# EAGLE design 000044 XXX Rev 1.00 (EAGLE 9.6.2)
DATE: 01.07.2020; OWNER: Kallio Designs; PCBA_PN: XXXXXX; PCB_PN: XXXXXX; REVISION: 1.0; TITLE: Modify global attributes; Z_SHEET2: Sheet 2; Z_SHEET3: Sheet 3; Z_SHEET4: Sheet 4; Z_SHEET5: Sheet 5; Z_SHEET6: Sheet 6; Z_SHEET7: Sheet 7; Z_SHEET8: Sheet 8
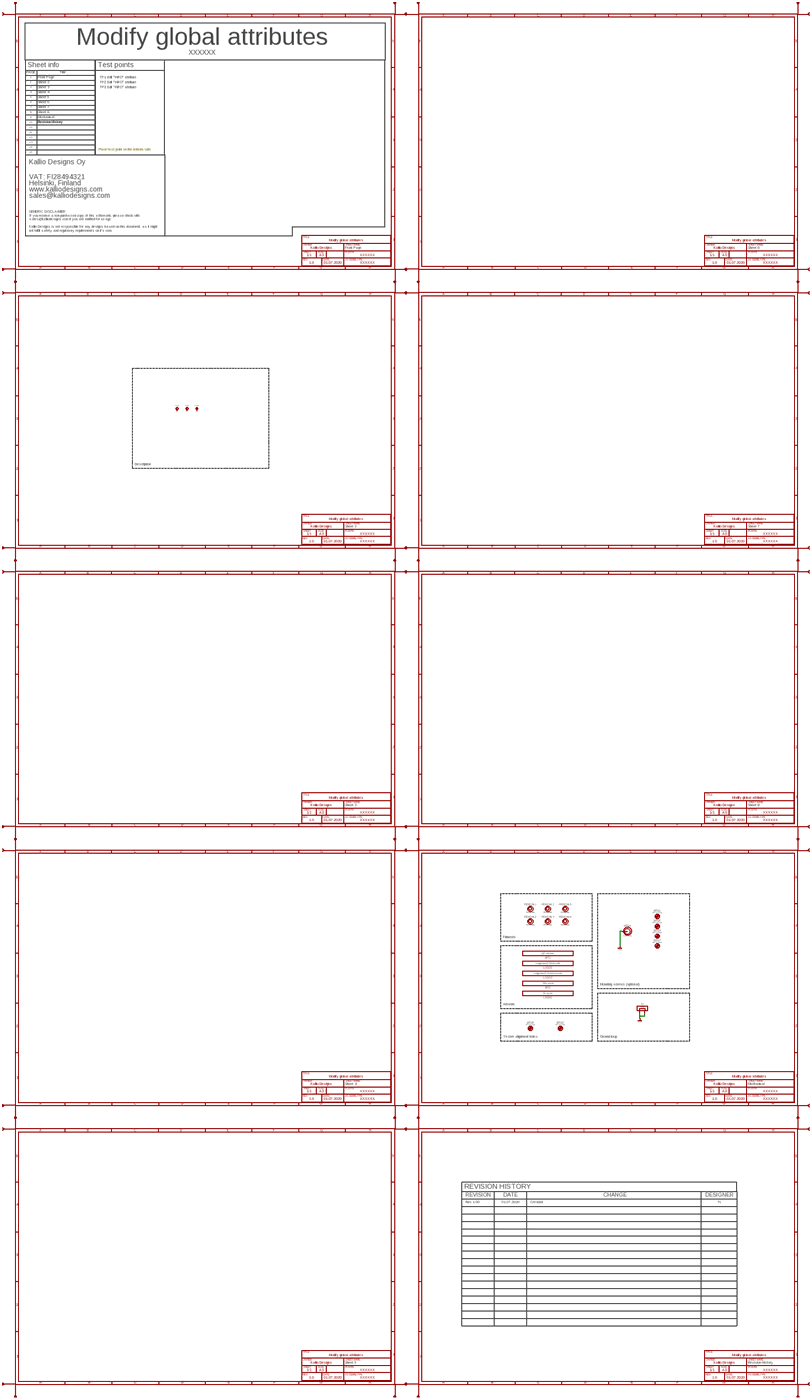
[diagram p0: schematic, sheet 1, overview]
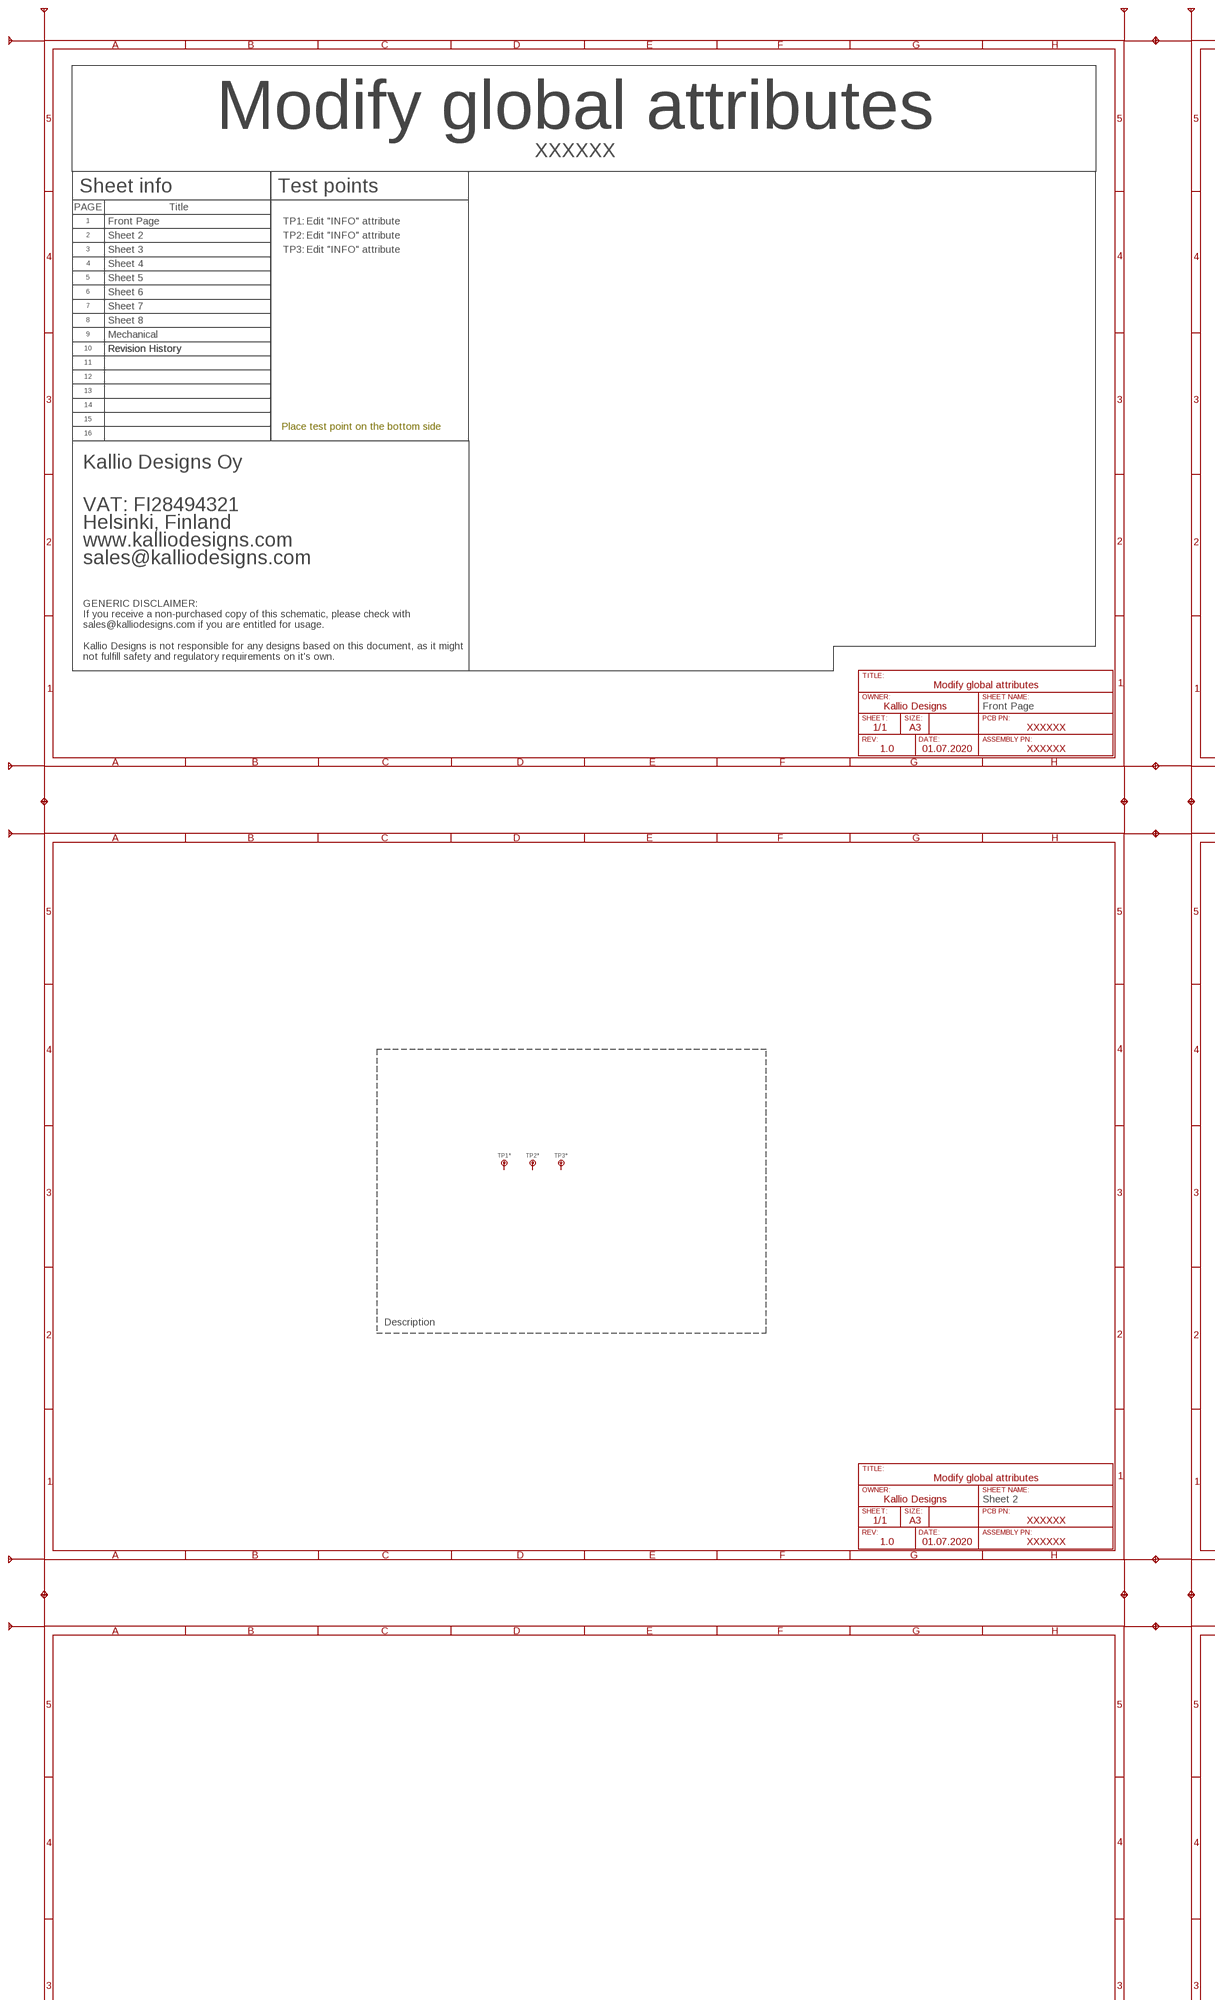
[diagram p1: schematic, sheet 1, part 1 of 4]
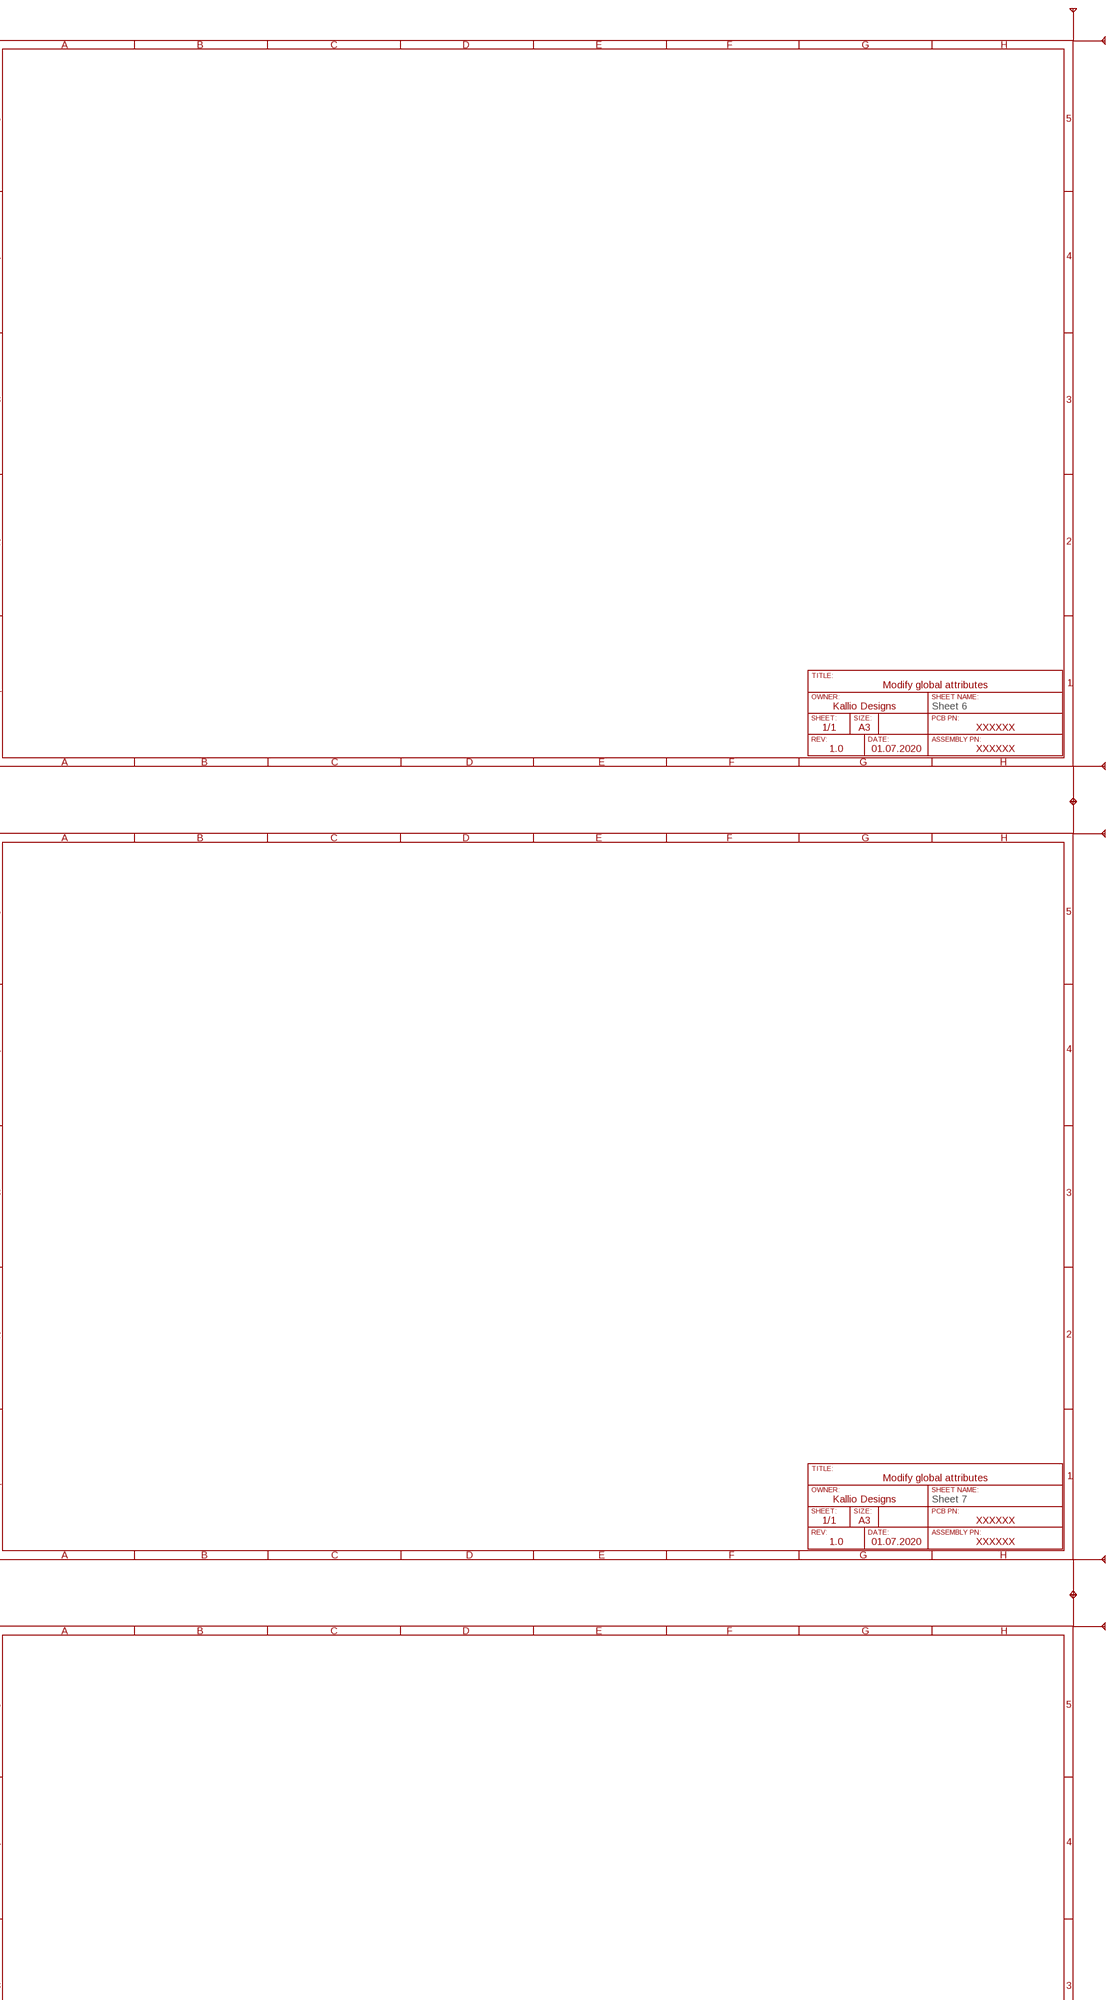
[diagram p2: schematic, sheet 1, part 2 of 4]
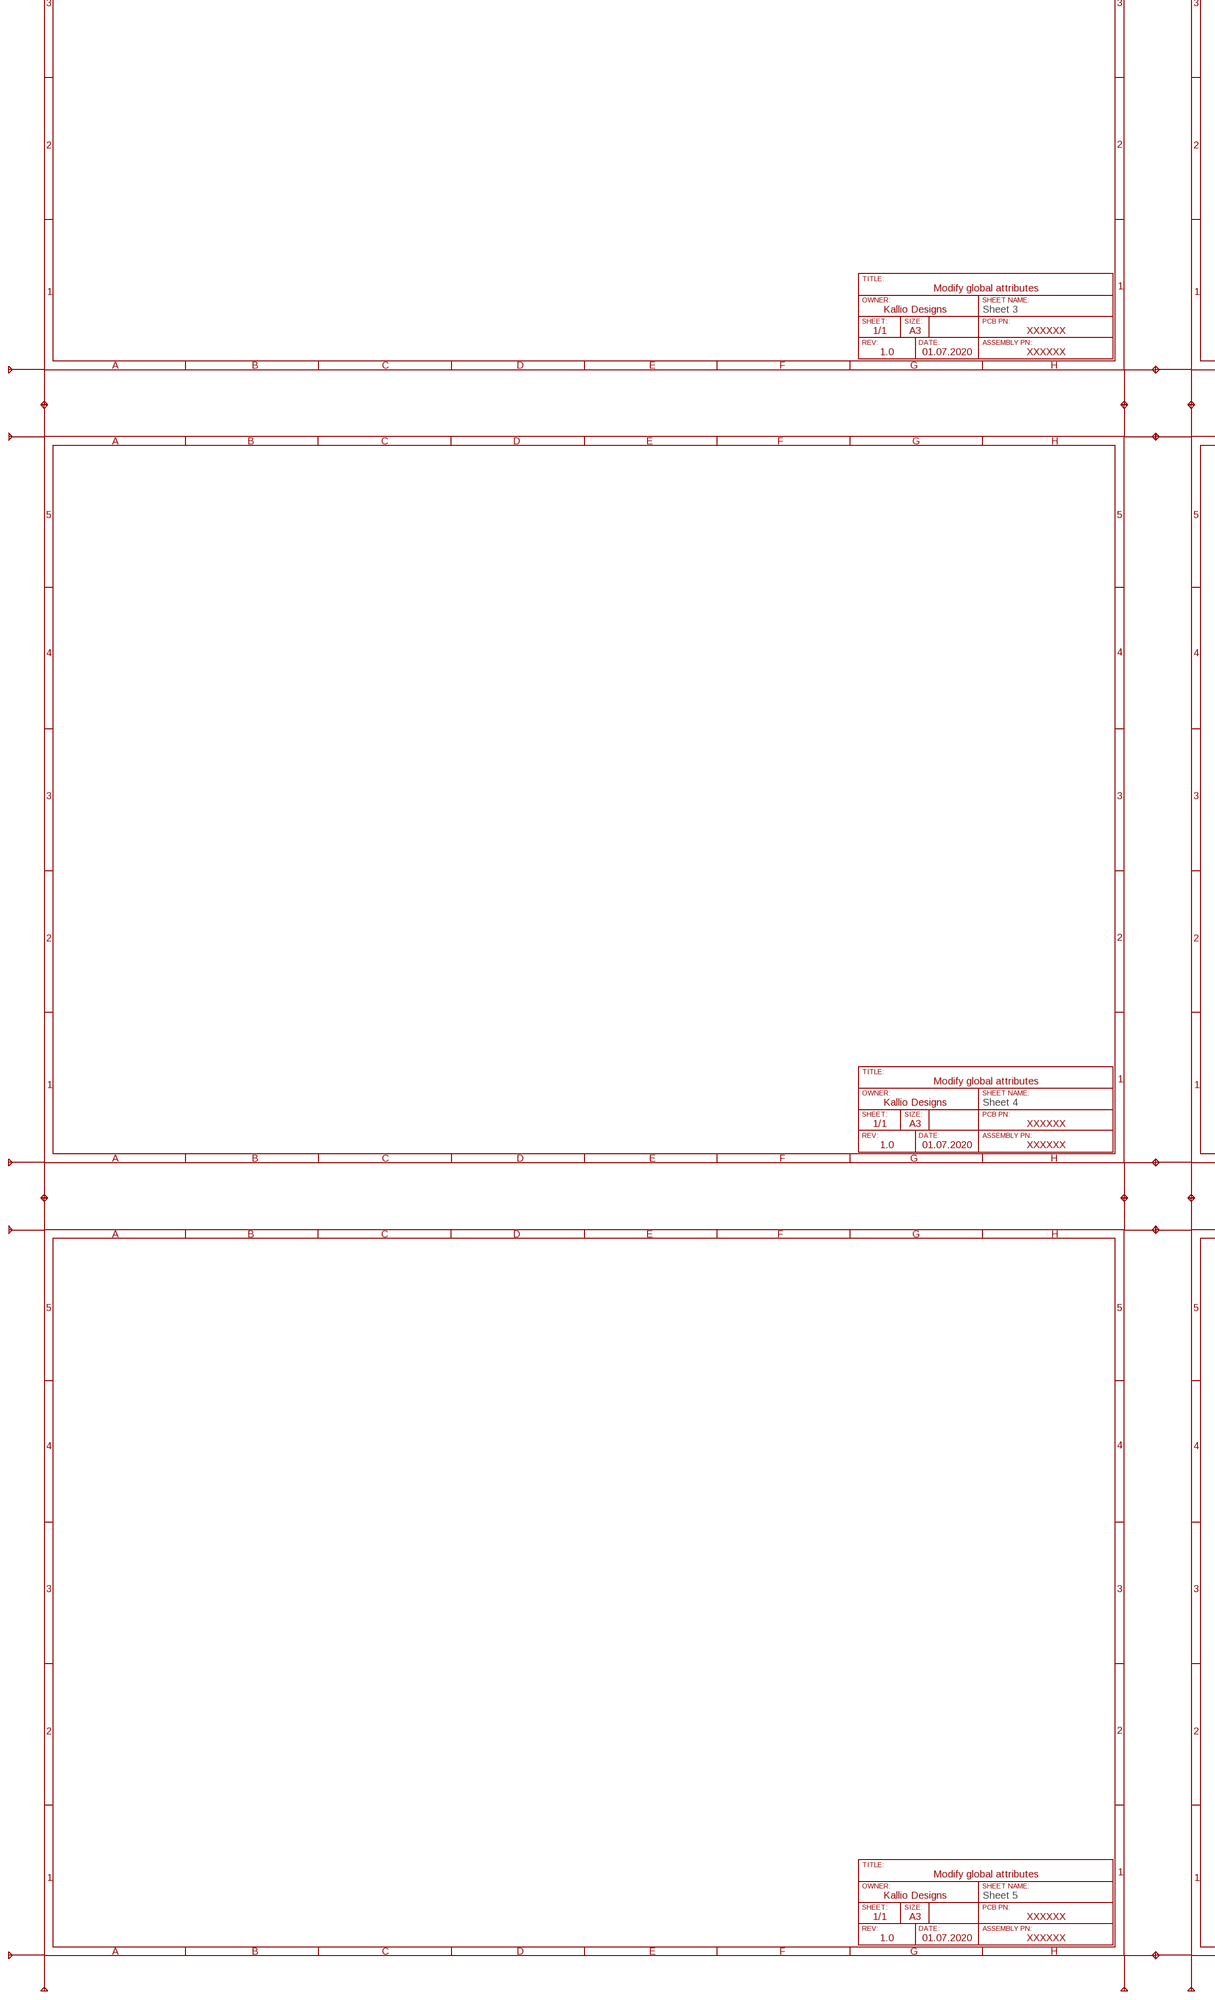
[diagram p3: schematic, sheet 1, part 3 of 4]
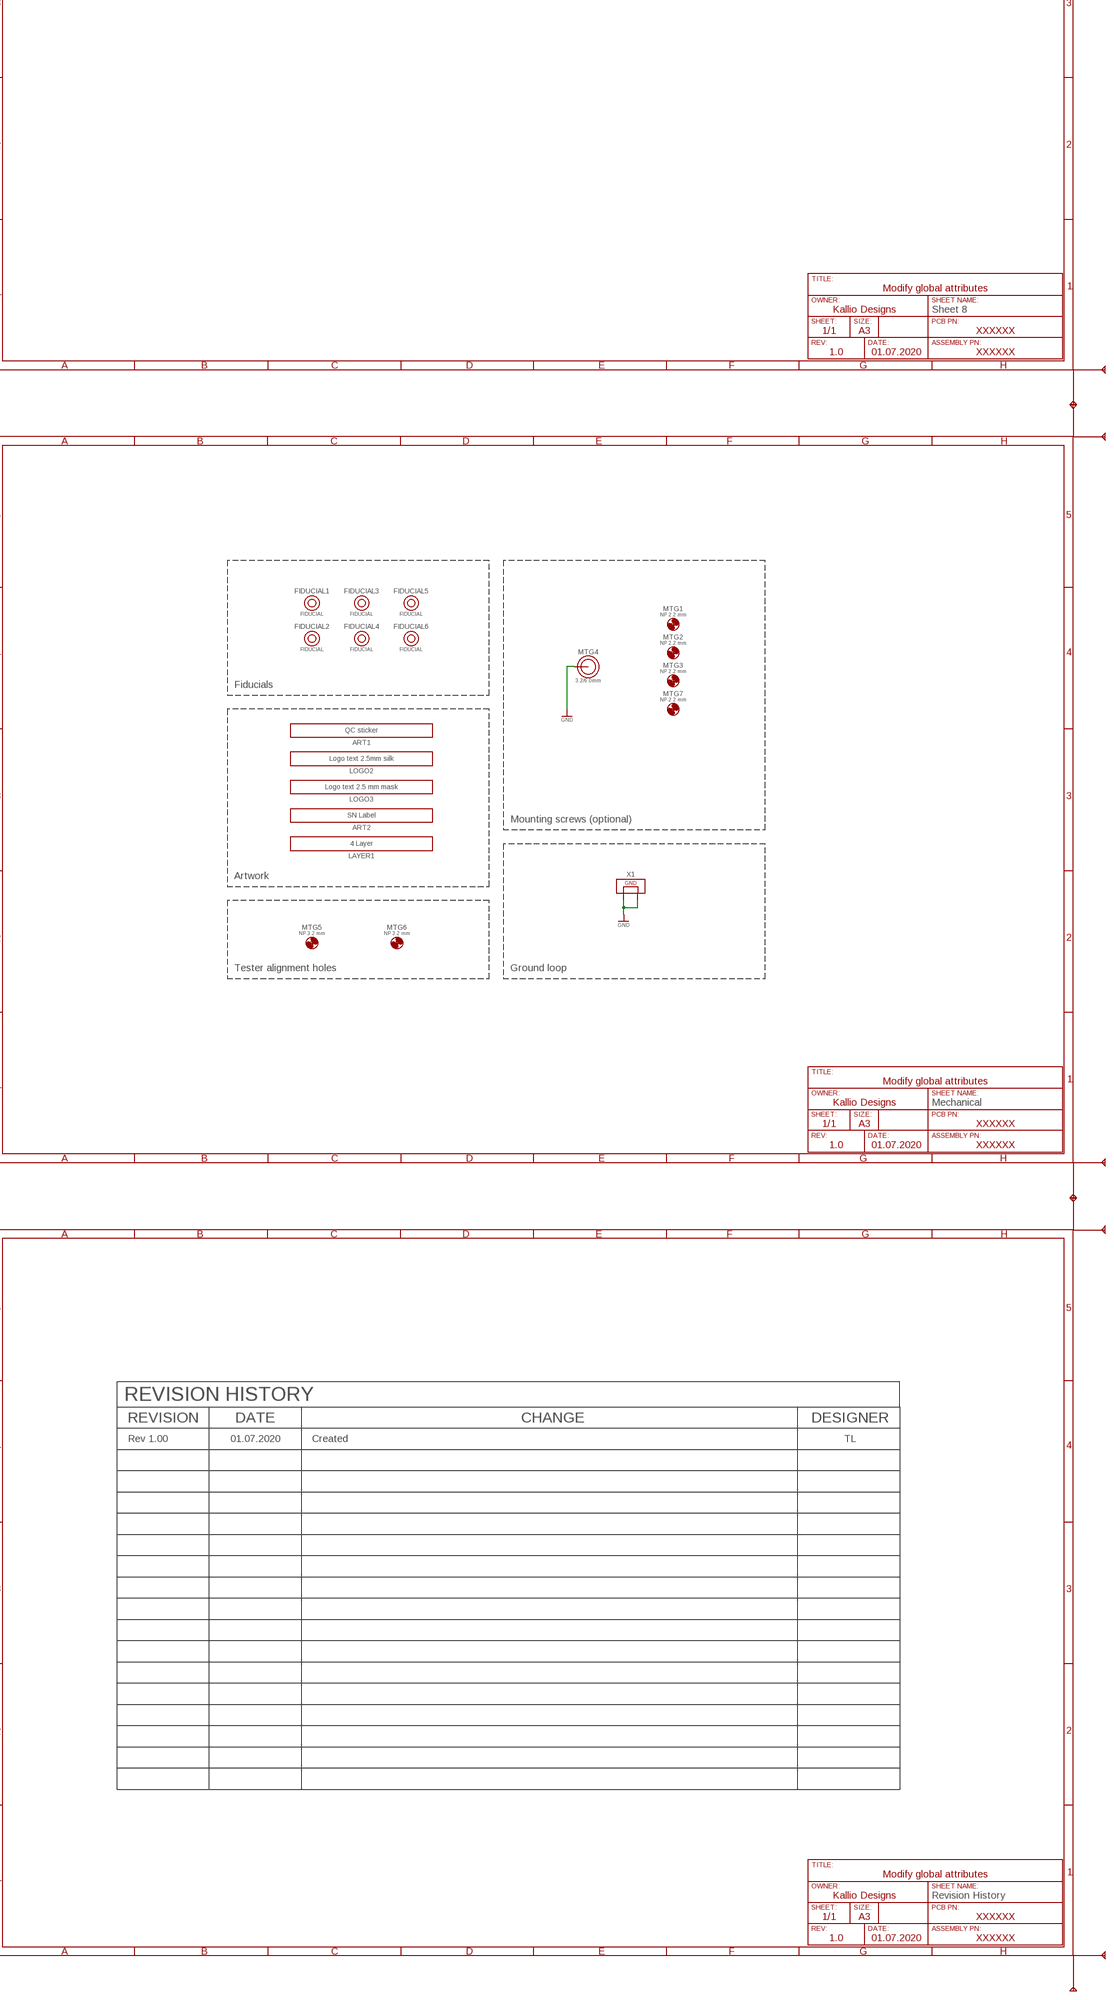
[diagram p4: schematic, sheet 1, part 4 of 4]
REVINFO1 (ART_REVISION_HISTORY): CODE: DNP; DNP: T; MANUFACTURER: DNP; MFG_PARTNO: DNP; PRICE: 0; SUPPLIER: DNP; SUPPLIER_PARTNO: DNP
SHEETINFO1 (ART_SHEET_INFO_1-16): CODE: DNP; DNP: T; MANUFACTURER: DNP; MFG_PARTNO: DNP; PRICE: 0; SUPPLIER: DNP; SUPPLIER_PARTNO: DNP
TEST_POINTS1 (ART_TEST_POINTS): CODE: DNP; DNP: T; MANUFACTURER: DNP; MFG_PARTNO: DNP; PRICE: 0; SUPPLIER: DNP; SUPPLIER_PARTNO: DNP

## Parts
ART1  ART_QC  [ART_QC_BIG]
ART2  ART_SN_LABEL-08X24  [ART_SN_8X24]
FIDUCIAL1  FIDUCIAL  [FIDUCIAL]
FIDUCIAL2  FIDUCIAL  [FIDUCIAL]
FIDUCIAL3  FIDUCIAL  [FIDUCIAL]
FIDUCIAL4  FIDUCIAL  [FIDUCIAL]
FIDUCIAL5  FIDUCIAL  [FIDUCIAL]
FIDUCIAL6  FIDUCIAL  [FIDUCIAL]
LAYER1  ART_LAYER_MARKING-4LAYER  [ART_4LAYER]
LOGO2  ART_LOGO_TEXT_2.5MM-SILK  [ART_LOGO_TEXT_2.5MM_SILK]
LOGO3  ART_LOGO_TEXT_2.5MM-MASK  [ART_LOGO_TEXT_2.5MM_MASK]
MTG1  HOL_2.2/4.2_NP  [MTG_NP_M2_220X420]
MTG2  HOL_2.2/4.2_NP  [MTG_NP_M2_220X420]
MTG3  HOL_2.2/4.2_NP  [MTG_NP_M2_220X420]
MTG4  HOL_3.2/6.0_PTH-3.2/6.0_PTH  [MTG_PTH_M3_320X600]
MTG5  HOL_3.2/6.0_NP-NOSILK  [MTG_NP_M3_320X600_NOSILK]
MTG6  HOL_3.2/6.0_NP-NOSILK  [MTG_NP_M3_320X600_NOSILK]
MTG7  HOL_2.2/4.2_NP  [MTG_NP_M2_220X420]
TP1  PAD_TEST_POINT-2.5MM  [TEST_POINT_2.5MM]
TP2  PAD_TEST_POINT-2.5MM  [TEST_POINT_2.5MM]
TP3  PAD_TEST_POINT-2.5MM  [TEST_POINT_2.5MM]
X1  PAD_TEST_GROUND_HOOK  [PAD_GND_HOOK_M]

## Nets
GND [100V/1A]: MTG4.1 X1.P$1 X1.P$2
Unconnected: TP1.P$1 TP2.P$1 TP3.P$1

## Notes on the sheet
- Front Page
- Mechanical
- Revision History | Revision History
- Place test point on the bottom side
- Kallio Designs Oy
- VAT: FI28494321
- Helsinki, Finland
- www.kalliodesigns.com
- sales@kalliodesigns.com
- GENERIC DISCLAIMER:
  If you receive a non-purchased copy of this schematic, please check with
  sales@kalliodesigns.com if you are entitled for usage.
  
  Kallio Designs is not responsible for any designs based on this document, as it might
  not fulfill safety and regulatory requirements on it's own.
- Front Page
- Description
- Fiducials
- Mounting screws (optional)
- Artwork
- Tester alignment holes | Ground loop
- Mechanical
- Rev 1.00 | 01.07.2020 | Created | TL
- Revision History

## Library data of the parts
ART1 = Custom_Eagle_KD:ART_QC: Placeholder for quality control sticker; CODE: QC sticker; DNP: T; MANUFACTURER: DNP; MFG_PARTNO: DNP; PRICE: 0; SUPPLIER: Digi-Key; SUPPLIER_PARTNO: DNP
ART2 = Custom_Eagle_KD:ART_SN_LABEL: Placeholder for serial number sticker; CODE: SN Label; DNP: T; MANUFACTURER: DNP; MFG_PARTNO: DNP; PRICE: 0; SUPPLIER: Digi-Key; SUPPLIER_PARTNO: DNP
FIDUCIAL1-FIDUCIAL6 = Custom_Eagle_KD:FIDUCIAL; CODE: FIDUCIAL; DNP: T; MANUFACTURER: DNP; MFG_PARTNO: DNP; SUPPLIER: DNP; SUPPLIER_PARTNO: DNP
LAYER1 = Custom_Eagle_KD:ART_LAYER_MARKING: Datasheet <LINK_ADDRESS>; CODE: 4 Layer; DNP: T; MANUFACTURER: DNP; MFG_PARTNO: DNP; PRICE: DNP; SUPPLIER: DNP; SUPPLIER_PARTNO: DNP
LOGO2 = Custom_Eagle_KD:ART_LOGO_TEXT_2.5MM; CODE: Logo text 2.5mm silk; DNP: T; MANUFACTURER: DNP; MFG_PARTNO: DNP; PRICE: 0; SUPPLIER: DNP; SUPPLIER_PARTNO: DNP
LOGO3 = Custom_Eagle_KD:ART_LOGO_TEXT_2.5MM; CODE: Logo text 2.5 mm mask; DNP: T; MANUFACTURER: DNP; MFG_PARTNO: DNP; PRICE: 0; SUPPLIER: DNP; SUPPLIER_PARTNO: DNP
MTG1-MTG3 MTG7 = Custom_Eagle_KD:HOL_2.2/4.2_NP: Non-plated mounting hole; CODE: NP 2.2 mm; DNP: T; MANUFACTURER: DNP; MFG_PARTNO: DNP; PRICE: DNP; SUPPLIER: DNP; SUPPLIER_PARTNO: DNP
MTG4 = Custom_Eagle_KD:HOL_3.2/6.0_PTH; CODE: 3.2/6.0mm; DNP: T; MANUFACTURER: DNP; MFG_PARTNO: DNP; SUPPLIER: DNP; SUPPLIER_PARTNO: DNP
MTG5 MTG6 = Custom_Eagle_KD:HOL_3.2/6.0_NP: Non-plated mounting hole; CODE: NP 3.2 mm; DNP: T; MANUFACTURER: DNP; MFG_PARTNO: DNP; PRICE: DNP; SUPPLIER: DNP; SUPPLIER_PARTNO: DNP
TP1-TP3 = Custom_Eagle_KD:PAD_TEST_POINT: Test point. Not populated; CODE: DNP; DNP: T; INFO: Edit "INFO" attribute; MANUFACTURER: Do not populate; MFG_PARTNO: DNP; SUPPLIER: DNP; SUPPLIER_PARTNO: DNP
X1 = Custom_Eagle_KD:PAD_TEST_GROUND_HOOK; CODE: DNP; DNP: T; MANUFACTURER: Do not populate; MFG_PARTNO: DNP; PRICE: 0; SUPPLIER: DNP; SUPPLIER_PARTNO: DNP

## Net classes
1 100V/1A: width 0.5 mm, drill 0.9 mm
2 Analog: clearance 0.25 mm
3 Serial: clearance 0.25 mm

## Board
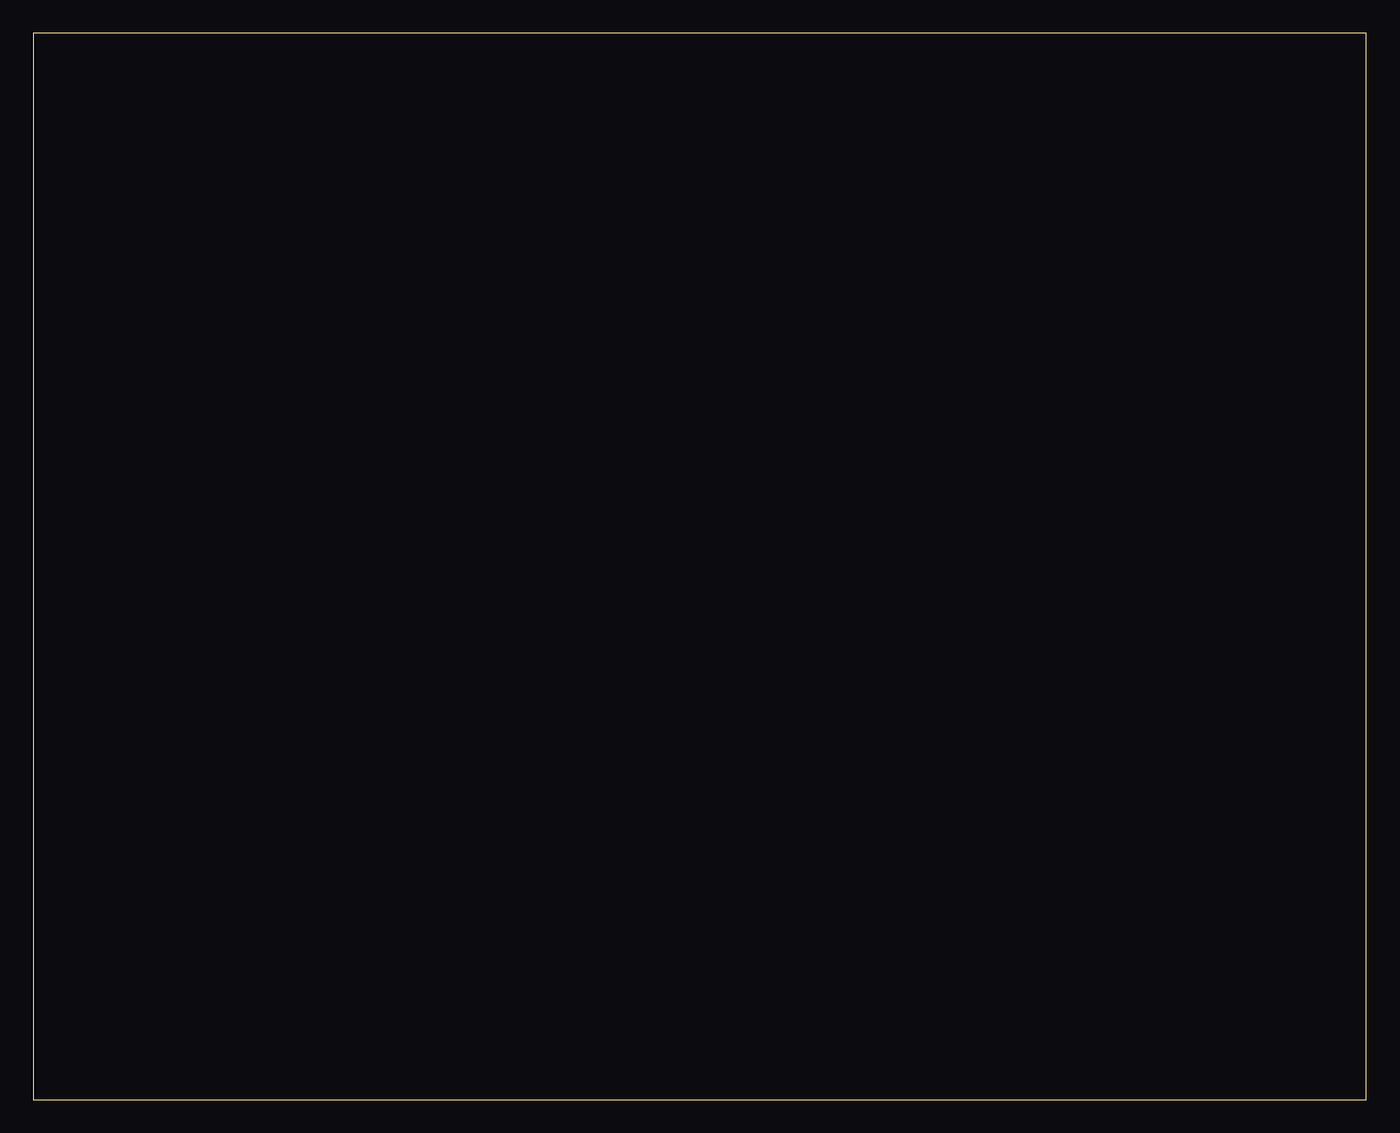
[diagram p5: board, top side]
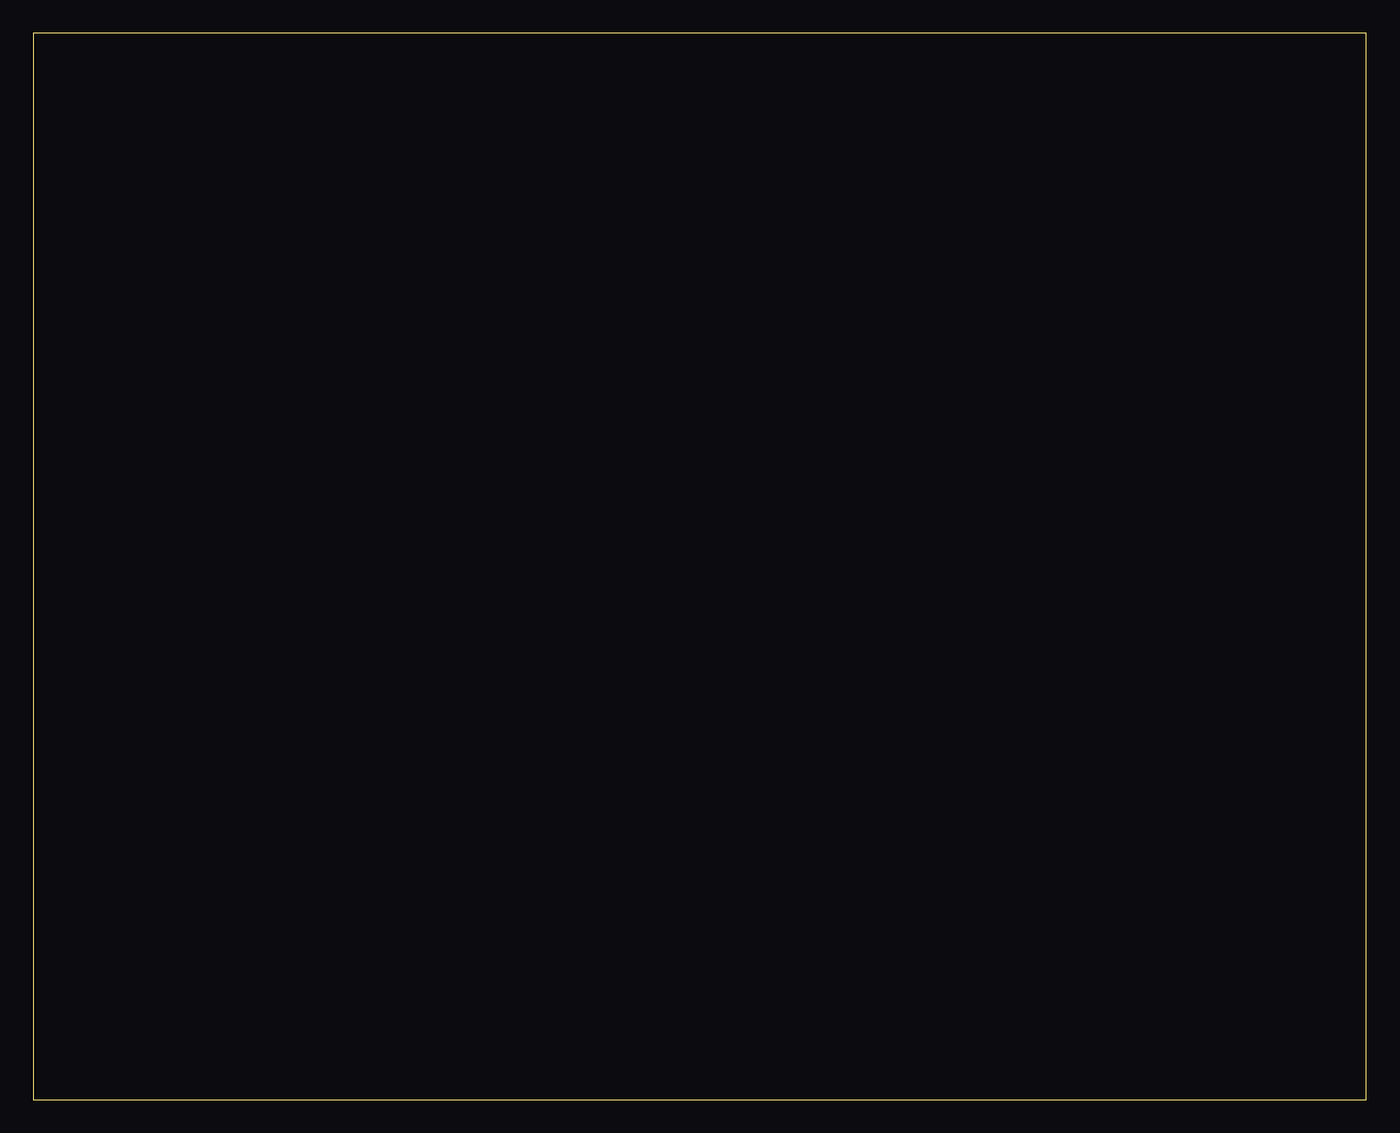
[diagram p6: board, inner layer Route2]
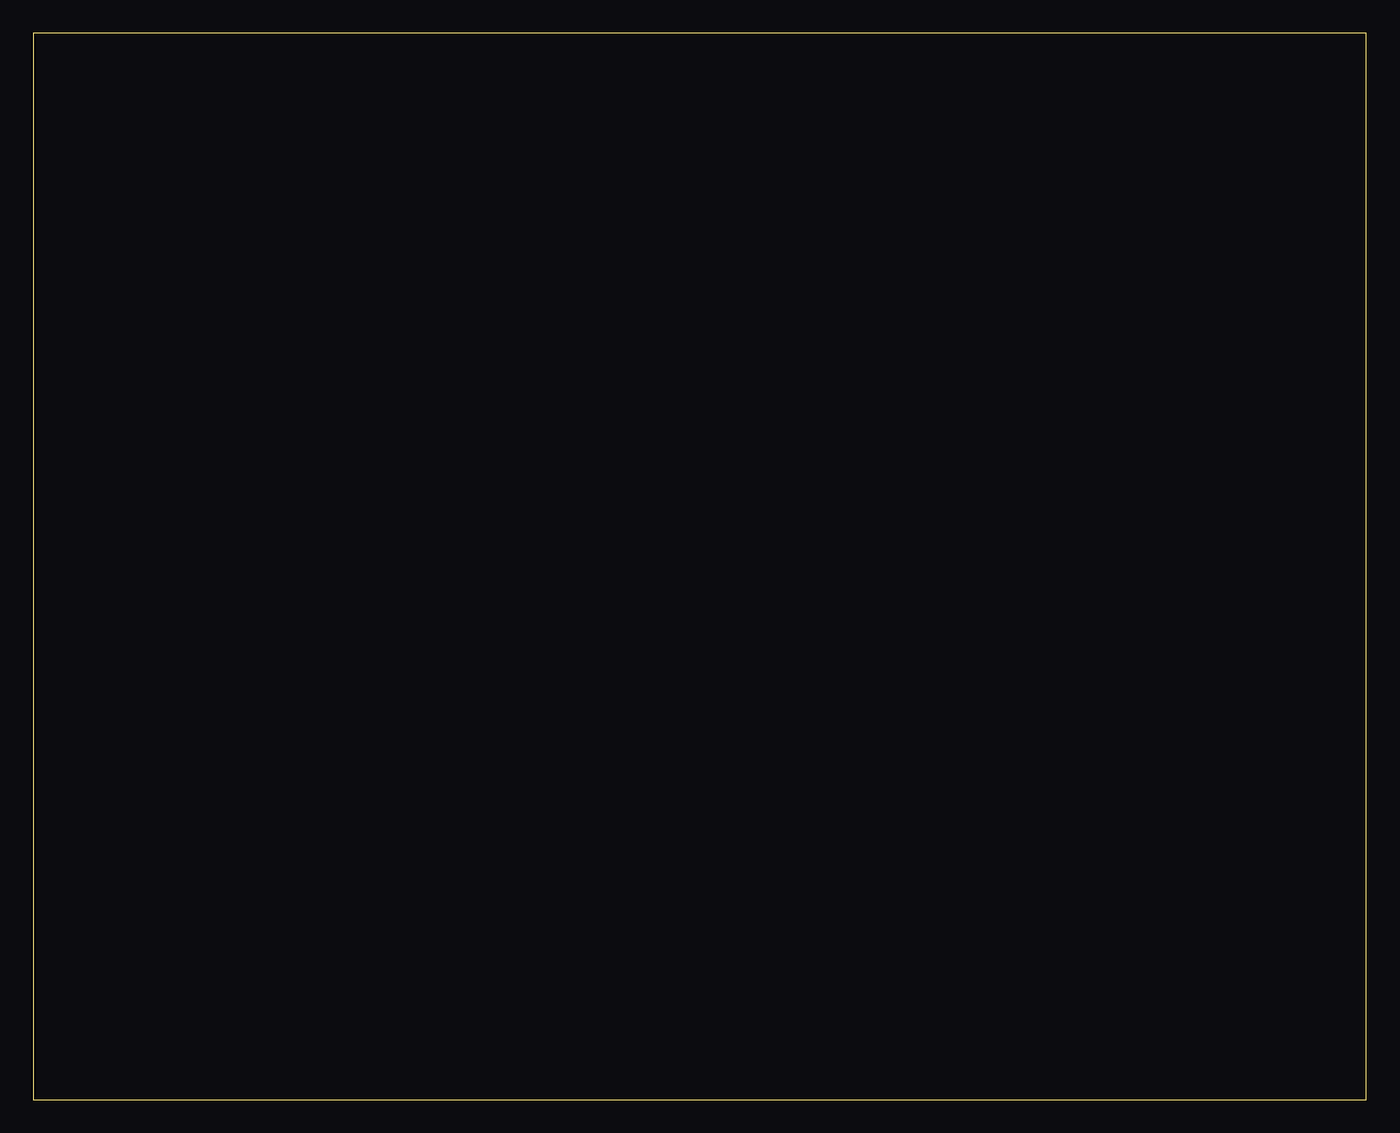
[diagram p7: board, inner layer Route15]
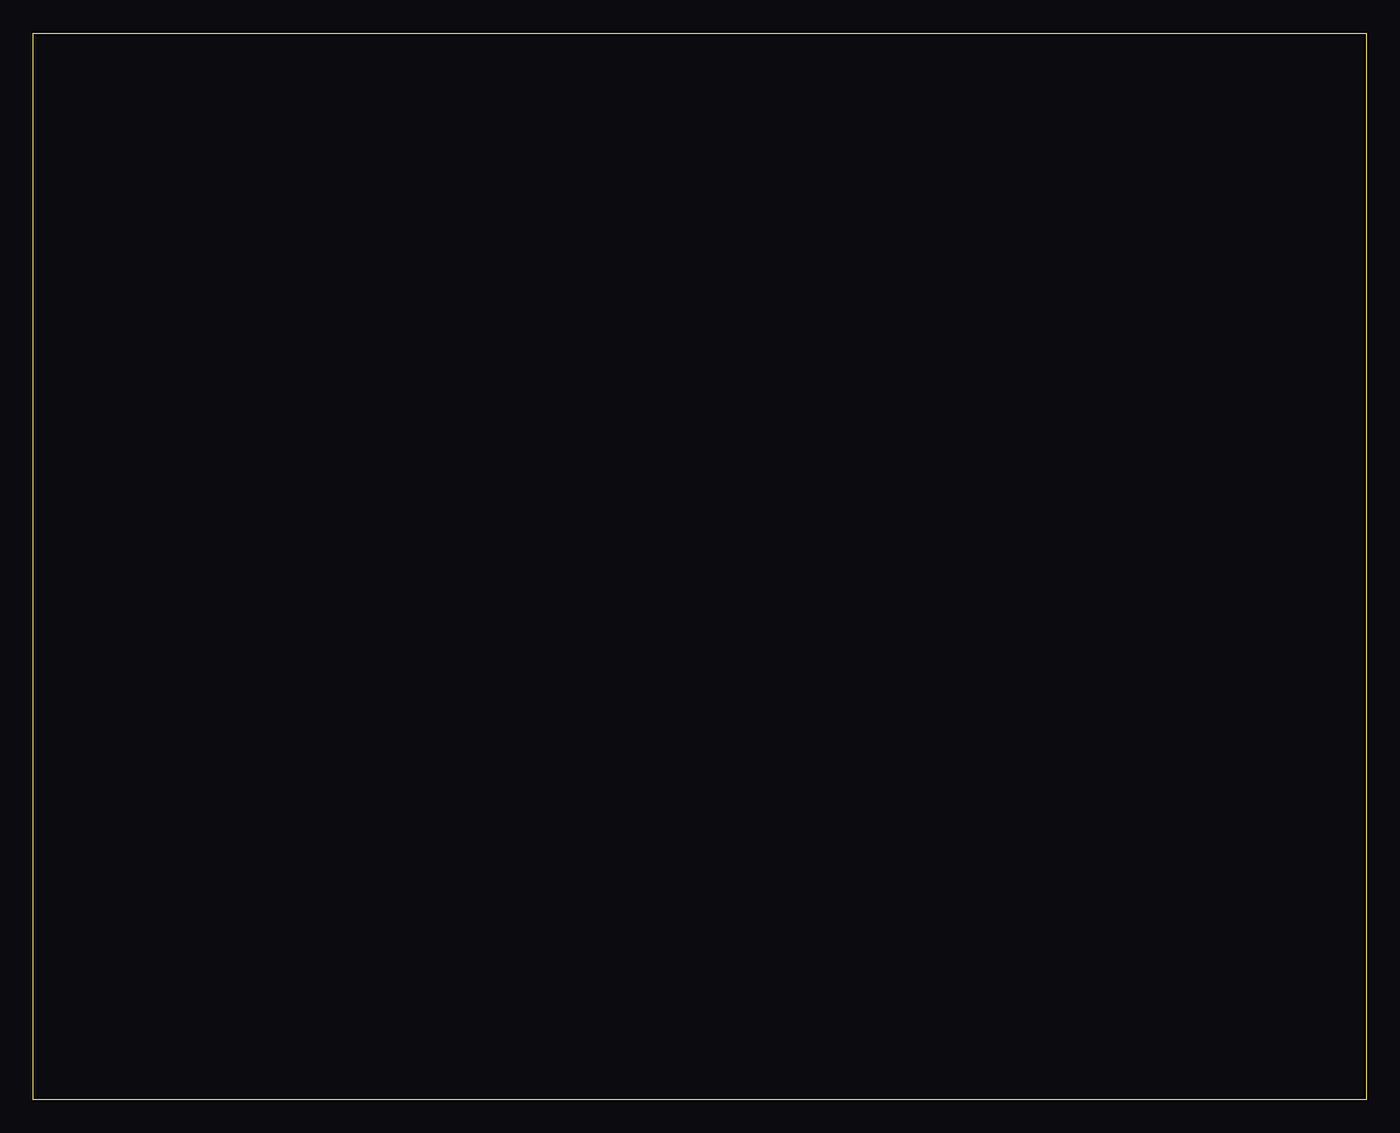
[diagram p8: board, bottom side, seen from below]

Size 100 x 80 mm. Coordinates in mm from the lower left corner, seen from the top.
Outline: 0,0 100,0 100,80 0,80 0,0
Copper layers (1+2*15+16): Top 0.035mm / dielectric 0.2mm / Route2 0.035mm / dielectric 1.3mm / Route15 0.035mm / dielectric 0.2mm / Bottom 0.035mm
Design rules "KD_rules_fine_4-layer": minimum track width 0.15mm, minimum drill 0.5mm, track to track 6mil, track to pad 6mil, pad to pad 6mil, via to via 6mil, smd to smd 0mil, copper to edge 10mil, drill to drill 10mil, minimum pad ring 0.2mm, minimum via ring 0.2mm, stop-mask expansion 2mil, vias tented up to drill 100mil, thermal gap 10mil
Milling: 63 lines

### Footprints (pad centres in the part's own frame; a part is rotated, then mirrored left to right if it is on the bottom)
MTG_NP_M2_220X420 = hole 2.2: 0,0
MTG_PTH_M3_320X600 = drill 3.2 pad 6: 1 0,0
MTG_NP_M3_320X600_NOSILK = hole 3.2: 0,0
TEST_POINT_2.5MM = smd 2.5 x 2.5: P$1 0,0
PAD_GND_HOOK_M = drill 1.2 pad 1.8 octagon: P$1 -5,0; P$2 5,0

### Placement (x,y rotation side)
ART1  -17,-1 0 top  (outside the outline)
ART2  -22,-15 0 top  (outside the outline)
FIDUCIAL1  0,-34 0 top  (outside the outline)
FIDUCIAL2  3,-34 0 top  (outside the outline)
FIDUCIAL3  -22,-38 0 top  (outside the outline)
FIDUCIAL4  -19,-38 0 top  (outside the outline)
FIDUCIAL5  -16,-38 0 top  (outside the outline)
FIDUCIAL6  -13,-38 0 top  (outside the outline)
LAYER1  -21,6 0 top  (outside the outline)
LOGO2  -12,-30 0 top  (outside the outline)
LOGO3  -12,-34 0 top  (outside the outline)
MTG1  -1,-19 0 top  (outside the outline)
MTG2  -21,-26 0 top  (outside the outline)
MTG3  -16,-26 0 top  (outside the outline)
MTG4  -20,-20 0 top  (outside the outline)
MTG5  -13,-20 0 top  (outside the outline)
MTG6  -7,-20 0 top  (outside the outline)
MTG7  -11,-26 0 top  (outside the outline)
TP1  -22,24 0 top  (outside the outline)
TP2  -22,21 0 top  (outside the outline)
TP3  -22,18 0 top  (outside the outline)
X1  -5,-38 0 top  (outside the outline)

### Tracks (layer width: path | path; a pad name or v marks a point on that pad's centre or on a via)
+3V1
  cutout Route15: -23.3,6.8 -18.8,6.8 -18.8,5.3 -23.3,5.3
GND  (2 unrouted)
GND1
  cutout Route2: -23.3,6.8 -18.8,6.8 -18.8,5.3 -23.3,5.3

### Text on the board
Top: L1 TOP LAYER
Route2: L2 mid-layer | 2
Route15: L3 mid-layer | 3
Bottom: L4 BOTTOM LAYER
tPlace: | | Silkscreen top
bPlace: Silkscreen bottom
tStop: Soldermask top
bStop: Soldermask bottom
tCream: Paste mask top
bCream: Paste mask bottom
Drills: Drill drawing
Milling: Drill tolerance < 2 mm drill | +/- 0.1 mm | Drill tolerance > 2 mm drill | +/- 10 % | General tolerances | IPC | Soldermask color | Order form | Silkscreen color | Order form | PCB Material | FR4 | Surface finish | HASL | PCB Final thickness (without mask) | 1.6 mm | PCB Build up: | L1: Top | Copper 35 um +/-10 % | Pregrep 200 um +/-5 % | L2: Mid | Copper 18 um +/-10 % | FR4 core 1000 um +/-10 % | L3: Mid | Copper 18 um +/-10 % | Pregrep 200 um +/-10 % | L4: Bottom | Copper 35 um +/-10 % | Drill drawing
Document: PN: | PCB Rev: